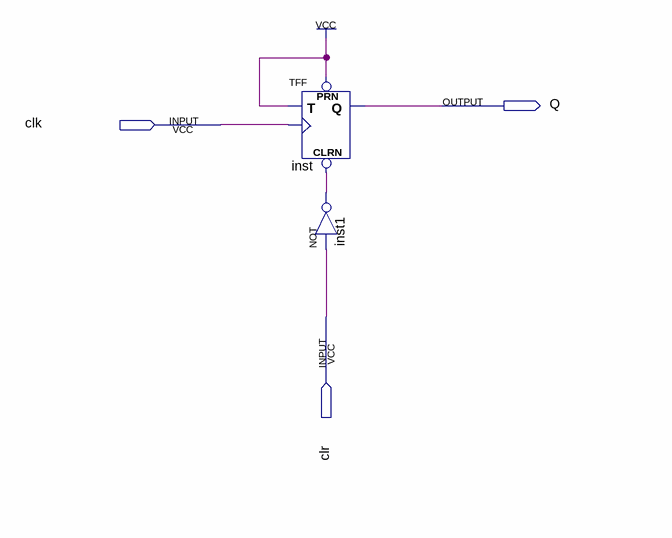
[diagram p0: schematic sheet]
// Quartus schematic ff_box.bdf as structural Verilog: 2 symbols, 3 pins
module ff_box (
  input  clk,
  input  clr,
  output Q
);

  wire inst1_out;

  TFF inst (.PRN(1'b1), .CLRN(inst1_out), .T(1'b1), .CLK(clk), .Q(Q));
  not inst1 (inst1_out, clr);
endmodule
